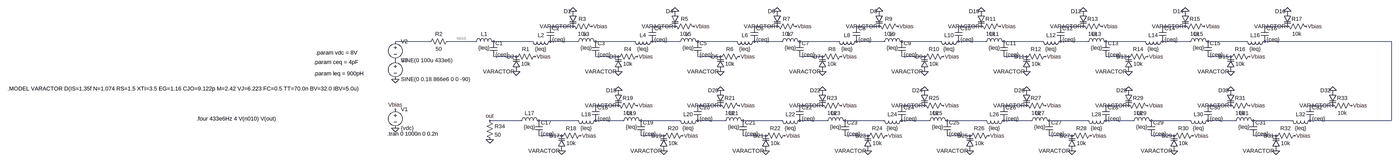
[diagram p0: schematic Parametric_amplifier_second_iteration(probably not working).asc, whole sheet]
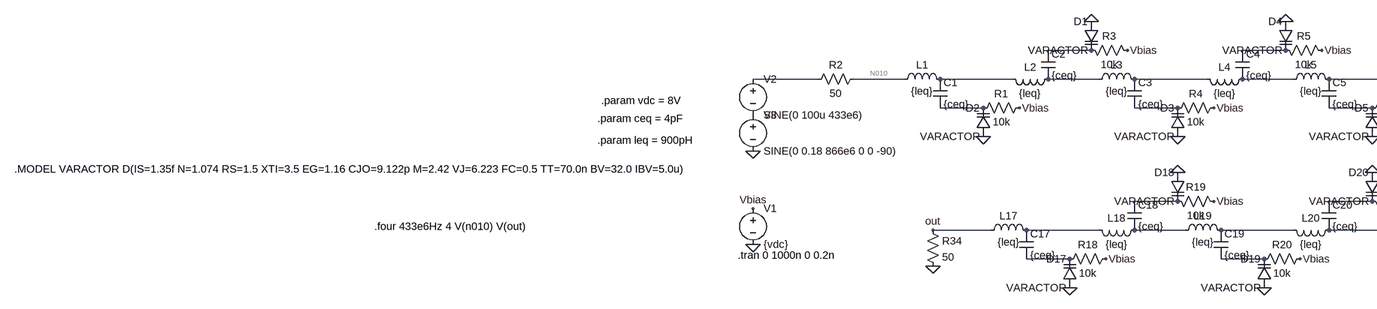
[diagram p1: schematic Parametric_amplifier_second_iteration(probably not working).asc, part, row 1 of 1, column 1 of 2]
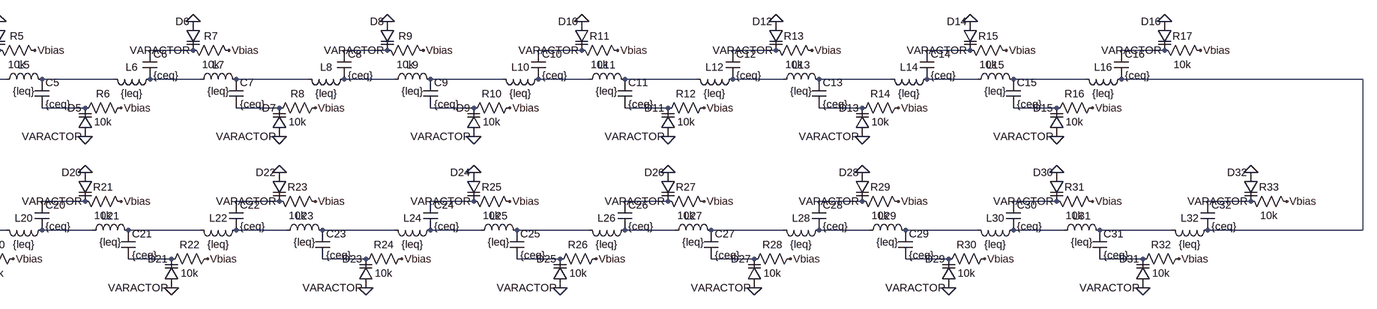
[diagram p2: schematic Parametric_amplifier_second_iteration(probably not working).asc, part, row 1 of 1, column 2 of 2]
Parametric_amplifier_second_iteration(probably not working).asc, the LTspice schematic file:
Version 4
SHEET 1 4228 680
WIRE 704 128 608 128
WIRE 1136 128 1040 128
WIRE 1568 128 1472 128
WIRE 2000 128 1904 128
WIRE 2432 128 2336 128
WIRE 2864 128 2768 128
WIRE 3296 128 3200 128
WIRE 3728 128 3632 128
WIRE 96 192 -48 192
WIRE 288 192 176 192
WIRE 528 192 368 192
WIRE 720 192 608 192
WIRE 960 192 800 192
WIRE 1152 192 1040 192
WIRE 1392 192 1232 192
WIRE 1584 192 1472 192
WIRE 1824 192 1664 192
WIRE 2016 192 1904 192
WIRE 2256 192 2096 192
WIRE 2448 192 2336 192
WIRE 2688 192 2528 192
WIRE 2880 192 2768 192
WIRE 3120 192 2960 192
WIRE 3312 192 3200 192
WIRE 3552 192 3392 192
WIRE 4224 192 3632 192
WIRE 464 256 368 256
WIRE 896 256 800 256
WIRE 1328 256 1232 256
WIRE 1760 256 1664 256
WIRE 2192 256 2096 256
WIRE 2624 256 2528 256
WIRE 3056 256 2960 256
WIRE 3488 256 3392 256
WIRE 896 464 800 464
WIRE 1328 464 1232 464
WIRE 1760 464 1664 464
WIRE 2192 464 2096 464
WIRE 2624 464 2528 464
WIRE 3056 464 2960 464
WIRE 3488 464 3392 464
WIRE 3920 464 3824 464
WIRE 480 528 352 528
WIRE 720 528 560 528
WIRE 912 528 800 528
WIRE 1152 528 992 528
WIRE 1344 528 1232 528
WIRE 1584 528 1424 528
WIRE 1776 528 1664 528
WIRE 2016 528 1856 528
WIRE 2208 528 2096 528
WIRE 2448 528 2288 528
WIRE 2640 528 2528 528
WIRE 2880 528 2720 528
WIRE 3072 528 2960 528
WIRE 3312 528 3152 528
WIRE 3504 528 3392 528
WIRE 3744 528 3584 528
WIRE 4224 528 4224 192
WIRE 4224 528 3824 528
WIRE 656 592 560 592
WIRE 1088 592 992 592
WIRE 1520 592 1424 592
WIRE 1952 592 1856 592
WIRE 2384 592 2288 592
WIRE 2816 592 2720 592
WIRE 3248 592 3152 592
WIRE 3680 592 3584 592
FLAG 464 320 0
FLAG 544 256 Vbias
FLAG -48 480 Vbias
FLAG -48 560 0
FLAG -48 352 0
FLAG 704 64 0
FLAG 784 128 Vbias
FLAG 896 320 0
FLAG 976 256 Vbias
FLAG 1136 64 0
FLAG 1216 128 Vbias
FLAG 1328 320 0
FLAG 1408 256 Vbias
FLAG 1568 64 0
FLAG 1648 128 Vbias
FLAG 1760 320 0
FLAG 1840 256 Vbias
FLAG 2000 64 0
FLAG 2080 128 Vbias
FLAG 2192 320 0
FLAG 2272 256 Vbias
FLAG 2432 64 0
FLAG 2512 128 Vbias
FLAG 2624 320 0
FLAG 2704 256 Vbias
FLAG 2864 64 0
FLAG 2944 128 Vbias
FLAG 3056 320 0
FLAG 3136 256 Vbias
FLAG 3296 64 0
FLAG 3376 128 Vbias
FLAG 3488 320 0
FLAG 3568 256 Vbias
FLAG 3728 64 0
FLAG 3808 128 Vbias
FLAG 656 656 0
FLAG 736 592 Vbias
FLAG 896 400 0
FLAG 976 464 Vbias
FLAG 1088 656 0
FLAG 1168 592 Vbias
FLAG 1328 400 0
FLAG 1408 464 Vbias
FLAG 1520 656 0
FLAG 1600 592 Vbias
FLAG 1760 400 0
FLAG 1840 464 Vbias
FLAG 1952 656 0
FLAG 2032 592 Vbias
FLAG 2192 400 0
FLAG 2272 464 Vbias
FLAG 2384 656 0
FLAG 2464 592 Vbias
FLAG 2624 400 0
FLAG 2704 464 Vbias
FLAG 2816 656 0
FLAG 2896 592 Vbias
FLAG 3056 400 0
FLAG 3136 464 Vbias
FLAG 3248 656 0
FLAG 3328 592 Vbias
FLAG 3488 400 0
FLAG 3568 464 Vbias
FLAG 3680 656 0
FLAG 3760 592 Vbias
FLAG 3920 400 0
FLAG 4000 464 Vbias
FLAG 352 608 0
FLAG 352 528 out
SYMBOL varactor 480 320 R180
WINDOW 0 24 64 Left 2
WINDOW 3 24 0 Left 2
SYMATTR InstName D2
SYMATTR Value VARACTOR
SYMBOL res 560 240 R90
WINDOW 0 0 56 VBottom 2
WINDOW 3 32 56 VTop 2
SYMATTR InstName R1
SYMATTR Value 10k
SYMBOL cap 352 192 R0
SYMATTR InstName C1
SYMATTR Value {ceq}
SYMBOL ind 272 208 R270
WINDOW 0 32 56 VTop 2
WINDOW 3 5 56 VBottom 2
SYMATTR InstName L1
SYMATTR Value {leq}
SYMBOL voltage -48 464 R0
WINDOW 123 0 0 Left 0
WINDOW 39 0 0 Left 0
SYMATTR InstName V1
SYMATTR Value {vdc}
SYMBOL voltage -48 176 R0
WINDOW 123 0 0 Left 0
WINDOW 39 0 0 Left 0
SYMATTR InstName V2
SYMATTR Value SINE(0 100u 433e6)
SYMBOL voltage -48 256 R0
WINDOW 123 0 0 Left 0
WINDOW 39 0 0 Left 0
SYMATTR InstName V3
SYMATTR Value SINE(0 0.18 866e6 0 0 -90)
SYMBOL res 192 176 R90
WINDOW 0 0 56 VBottom 2
WINDOW 3 32 56 VTop 2
SYMATTR InstName R2
SYMATTR Value 50
SYMBOL varactor 720 64 M0
SYMATTR InstName D1
SYMATTR Value VARACTOR
SYMBOL res 800 144 M270
WINDOW 0 32 56 VTop 2
WINDOW 3 0 56 VBottom 2
SYMATTR InstName R3
SYMATTR Value 10k
SYMBOL cap 592 192 M180
WINDOW 0 24 56 Left 2
WINDOW 3 24 8 Left 2
SYMATTR InstName C2
SYMATTR Value {ceq}
SYMBOL ind 512 176 M90
WINDOW 0 5 56 VBottom 2
WINDOW 3 32 56 VTop 2
SYMATTR InstName L2
SYMATTR Value {leq}
SYMBOL varactor 912 320 R180
WINDOW 0 24 64 Left 2
WINDOW 3 24 0 Left 2
SYMATTR InstName D3
SYMATTR Value VARACTOR
SYMBOL res 992 240 R90
WINDOW 0 0 56 VBottom 2
WINDOW 3 32 56 VTop 2
SYMATTR InstName R4
SYMATTR Value 10k
SYMBOL cap 784 192 R0
SYMATTR InstName C3
SYMATTR Value {ceq}
SYMBOL ind 704 208 R270
WINDOW 0 32 56 VTop 2
WINDOW 3 5 56 VBottom 2
SYMATTR InstName L3
SYMATTR Value {leq}
SYMBOL varactor 1152 64 M0
SYMATTR InstName D4
SYMATTR Value VARACTOR
SYMBOL res 1232 144 M270
WINDOW 0 32 56 VTop 2
WINDOW 3 0 56 VBottom 2
SYMATTR InstName R5
SYMATTR Value 10k
SYMBOL cap 1024 192 M180
WINDOW 0 24 56 Left 2
WINDOW 3 24 8 Left 2
SYMATTR InstName C4
SYMATTR Value {ceq}
SYMBOL ind 944 176 M90
WINDOW 0 5 56 VBottom 2
WINDOW 3 32 56 VTop 2
SYMATTR InstName L4
SYMATTR Value {leq}
SYMBOL varactor 1344 320 R180
WINDOW 0 24 64 Left 2
WINDOW 3 24 0 Left 2
SYMATTR InstName D5
SYMATTR Value VARACTOR
SYMBOL res 1424 240 R90
WINDOW 0 0 56 VBottom 2
WINDOW 3 32 56 VTop 2
SYMATTR InstName R6
SYMATTR Value 10k
SYMBOL cap 1216 192 R0
SYMATTR InstName C5
SYMATTR Value {ceq}
SYMBOL ind 1136 208 R270
WINDOW 0 32 56 VTop 2
WINDOW 3 5 56 VBottom 2
SYMATTR InstName L5
SYMATTR Value {leq}
SYMBOL varactor 1584 64 M0
SYMATTR InstName D6
SYMATTR Value VARACTOR
SYMBOL res 1664 144 M270
WINDOW 0 32 56 VTop 2
WINDOW 3 0 56 VBottom 2
SYMATTR InstName R7
SYMATTR Value 10k
SYMBOL cap 1456 192 M180
WINDOW 0 24 56 Left 2
WINDOW 3 24 8 Left 2
SYMATTR InstName C6
SYMATTR Value {ceq}
SYMBOL ind 1376 176 M90
WINDOW 0 5 56 VBottom 2
WINDOW 3 32 56 VTop 2
SYMATTR InstName L6
SYMATTR Value {leq}
SYMBOL varactor 1776 320 R180
WINDOW 0 24 64 Left 2
WINDOW 3 24 0 Left 2
SYMATTR InstName D7
SYMATTR Value VARACTOR
SYMBOL res 1856 240 R90
WINDOW 0 0 56 VBottom 2
WINDOW 3 32 56 VTop 2
SYMATTR InstName R8
SYMATTR Value 10k
SYMBOL cap 1648 192 R0
SYMATTR InstName C7
SYMATTR Value {ceq}
SYMBOL ind 1568 208 R270
WINDOW 0 32 56 VTop 2
WINDOW 3 5 56 VBottom 2
SYMATTR InstName L7
SYMATTR Value {leq}
SYMBOL varactor 2016 64 M0
SYMATTR InstName D8
SYMATTR Value VARACTOR
SYMBOL res 2096 144 M270
WINDOW 0 32 56 VTop 2
WINDOW 3 0 56 VBottom 2
SYMATTR InstName R9
SYMATTR Value 10k
SYMBOL cap 1888 192 M180
WINDOW 0 24 56 Left 2
WINDOW 3 24 8 Left 2
SYMATTR InstName C8
SYMATTR Value {ceq}
SYMBOL ind 1808 176 M90
WINDOW 0 5 56 VBottom 2
WINDOW 3 32 56 VTop 2
SYMATTR InstName L8
SYMATTR Value {leq}
SYMBOL varactor 2208 320 R180
WINDOW 0 24 64 Left 2
WINDOW 3 24 0 Left 2
SYMATTR InstName D9
SYMATTR Value VARACTOR
SYMBOL res 2288 240 R90
WINDOW 0 0 56 VBottom 2
WINDOW 3 32 56 VTop 2
SYMATTR InstName R10
SYMATTR Value 10k
SYMBOL cap 2080 192 R0
SYMATTR InstName C9
SYMATTR Value {ceq}
SYMBOL ind 2000 208 R270
WINDOW 0 32 56 VTop 2
WINDOW 3 5 56 VBottom 2
SYMATTR InstName L9
SYMATTR Value {leq}
SYMBOL varactor 2448 64 M0
SYMATTR InstName D10
SYMATTR Value VARACTOR
SYMBOL res 2528 144 M270
WINDOW 0 32 56 VTop 2
WINDOW 3 0 56 VBottom 2
SYMATTR InstName R11
SYMATTR Value 10k
SYMBOL cap 2320 192 M180
WINDOW 0 24 56 Left 2
WINDOW 3 24 8 Left 2
SYMATTR InstName C10
SYMATTR Value {ceq}
SYMBOL ind 2240 176 M90
WINDOW 0 5 56 VBottom 2
WINDOW 3 32 56 VTop 2
SYMATTR InstName L10
SYMATTR Value {leq}
SYMBOL varactor 2640 320 R180
WINDOW 0 24 64 Left 2
WINDOW 3 24 0 Left 2
SYMATTR InstName D11
SYMATTR Value VARACTOR
SYMBOL res 2720 240 R90
WINDOW 0 0 56 VBottom 2
WINDOW 3 32 56 VTop 2
SYMATTR InstName R12
SYMATTR Value 10k
SYMBOL cap 2512 192 R0
SYMATTR InstName C11
SYMATTR Value {ceq}
SYMBOL ind 2432 208 R270
WINDOW 0 32 56 VTop 2
WINDOW 3 5 56 VBottom 2
SYMATTR InstName L11
SYMATTR Value {leq}
SYMBOL varactor 2880 64 M0
SYMATTR InstName D12
SYMATTR Value VARACTOR
SYMBOL res 2960 144 M270
WINDOW 0 32 56 VTop 2
WINDOW 3 0 56 VBottom 2
SYMATTR InstName R13
SYMATTR Value 10k
SYMBOL cap 2752 192 M180
WINDOW 0 24 56 Left 2
WINDOW 3 24 8 Left 2
SYMATTR InstName C12
SYMATTR Value {ceq}
SYMBOL ind 2672 176 M90
WINDOW 0 5 56 VBottom 2
WINDOW 3 32 56 VTop 2
SYMATTR InstName L12
SYMATTR Value {leq}
SYMBOL varactor 3072 320 R180
WINDOW 0 24 64 Left 2
WINDOW 3 24 0 Left 2
SYMATTR InstName D13
SYMATTR Value VARACTOR
SYMBOL res 3152 240 R90
WINDOW 0 0 56 VBottom 2
WINDOW 3 32 56 VTop 2
SYMATTR InstName R14
SYMATTR Value 10k
SYMBOL cap 2944 192 R0
SYMATTR InstName C13
SYMATTR Value {ceq}
SYMBOL ind 2864 208 R270
WINDOW 0 32 56 VTop 2
WINDOW 3 5 56 VBottom 2
SYMATTR InstName L13
SYMATTR Value {leq}
SYMBOL varactor 3312 64 M0
SYMATTR InstName D14
SYMATTR Value VARACTOR
SYMBOL res 3392 144 M270
WINDOW 0 32 56 VTop 2
WINDOW 3 0 56 VBottom 2
SYMATTR InstName R15
SYMATTR Value 10k
SYMBOL cap 3184 192 M180
WINDOW 0 24 56 Left 2
WINDOW 3 24 8 Left 2
SYMATTR InstName C14
SYMATTR Value {ceq}
SYMBOL ind 3104 176 M90
WINDOW 0 5 56 VBottom 2
WINDOW 3 32 56 VTop 2
SYMATTR InstName L14
SYMATTR Value {leq}
SYMBOL varactor 3504 320 R180
WINDOW 0 24 64 Left 2
WINDOW 3 24 0 Left 2
SYMATTR InstName D15
SYMATTR Value VARACTOR
SYMBOL res 3584 240 R90
WINDOW 0 0 56 VBottom 2
WINDOW 3 32 56 VTop 2
SYMATTR InstName R16
SYMATTR Value 10k
SYMBOL cap 3376 192 R0
SYMATTR InstName C15
SYMATTR Value {ceq}
SYMBOL ind 3296 208 R270
WINDOW 0 32 56 VTop 2
WINDOW 3 5 56 VBottom 2
SYMATTR InstName L15
SYMATTR Value {leq}
SYMBOL varactor 3744 64 M0
SYMATTR InstName D16
SYMATTR Value VARACTOR
SYMBOL res 3824 144 M270
WINDOW 0 32 56 VTop 2
WINDOW 3 0 56 VBottom 2
SYMATTR InstName R17
SYMATTR Value 10k
SYMBOL cap 3616 192 M180
WINDOW 0 24 56 Left 2
WINDOW 3 24 8 Left 2
SYMATTR InstName C16
SYMATTR Value {ceq}
SYMBOL ind 3536 176 M90
WINDOW 0 5 56 VBottom 2
WINDOW 3 32 56 VTop 2
SYMATTR InstName L16
SYMATTR Value {leq}
SYMBOL varactor 672 656 R180
WINDOW 0 24 64 Left 2
WINDOW 3 24 0 Left 2
SYMATTR InstName D17
SYMATTR Value VARACTOR
SYMBOL res 752 576 R90
WINDOW 0 0 56 VBottom 2
WINDOW 3 32 56 VTop 2
SYMATTR InstName R18
SYMATTR Value 10k
SYMBOL cap 544 528 R0
SYMATTR InstName C17
SYMATTR Value {ceq}
SYMBOL ind 464 544 R270
WINDOW 0 32 56 VTop 2
WINDOW 3 5 56 VBottom 2
SYMATTR InstName L17
SYMATTR Value {leq}
SYMBOL varactor 912 400 M0
SYMATTR InstName D18
SYMATTR Value VARACTOR
SYMBOL res 992 480 M270
WINDOW 0 32 56 VTop 2
WINDOW 3 0 56 VBottom 2
SYMATTR InstName R19
SYMATTR Value 10k
SYMBOL cap 784 528 M180
WINDOW 0 24 56 Left 2
WINDOW 3 24 8 Left 2
SYMATTR InstName C18
SYMATTR Value {ceq}
SYMBOL ind 704 512 M90
WINDOW 0 5 56 VBottom 2
WINDOW 3 32 56 VTop 2
SYMATTR InstName L18
SYMATTR Value {leq}
SYMBOL varactor 1104 656 R180
WINDOW 0 24 64 Left 2
WINDOW 3 24 0 Left 2
SYMATTR InstName D19
SYMATTR Value VARACTOR
SYMBOL res 1184 576 R90
WINDOW 0 0 56 VBottom 2
WINDOW 3 32 56 VTop 2
SYMATTR InstName R20
SYMATTR Value 10k
SYMBOL cap 976 528 R0
SYMATTR InstName C19
SYMATTR Value {ceq}
SYMBOL ind 896 544 R270
WINDOW 0 32 56 VTop 2
WINDOW 3 5 56 VBottom 2
SYMATTR InstName L19
SYMATTR Value {leq}
SYMBOL varactor 1344 400 M0
SYMATTR InstName D20
SYMATTR Value VARACTOR
SYMBOL res 1424 480 M270
WINDOW 0 32 56 VTop 2
WINDOW 3 0 56 VBottom 2
SYMATTR InstName R21
SYMATTR Value 10k
SYMBOL cap 1216 528 M180
WINDOW 0 24 56 Left 2
WINDOW 3 24 8 Left 2
SYMATTR InstName C20
SYMATTR Value {ceq}
SYMBOL ind 1136 512 M90
WINDOW 0 5 56 VBottom 2
WINDOW 3 32 56 VTop 2
SYMATTR InstName L20
SYMATTR Value {leq}
SYMBOL varactor 1536 656 R180
WINDOW 0 24 64 Left 2
WINDOW 3 24 0 Left 2
SYMATTR InstName D21
SYMATTR Value VARACTOR
SYMBOL res 1616 576 R90
WINDOW 0 0 56 VBottom 2
WINDOW 3 32 56 VTop 2
SYMATTR InstName R22
SYMATTR Value 10k
SYMBOL cap 1408 528 R0
SYMATTR InstName C21
SYMATTR Value {ceq}
SYMBOL ind 1328 544 R270
WINDOW 0 32 56 VTop 2
WINDOW 3 5 56 VBottom 2
SYMATTR InstName L21
SYMATTR Value {leq}
SYMBOL varactor 1776 400 M0
SYMATTR InstName D22
SYMATTR Value VARACTOR
SYMBOL res 1856 480 M270
WINDOW 0 32 56 VTop 2
WINDOW 3 0 56 VBottom 2
SYMATTR InstName R23
SYMATTR Value 10k
SYMBOL cap 1648 528 M180
WINDOW 0 24 56 Left 2
WINDOW 3 24 8 Left 2
SYMATTR InstName C22
SYMATTR Value {ceq}
SYMBOL ind 1568 512 M90
WINDOW 0 5 56 VBottom 2
WINDOW 3 32 56 VTop 2
SYMATTR InstName L22
SYMATTR Value {leq}
SYMBOL varactor 1968 656 R180
WINDOW 0 24 64 Left 2
WINDOW 3 24 0 Left 2
SYMATTR InstName D23
SYMATTR Value VARACTOR
SYMBOL res 2048 576 R90
WINDOW 0 0 56 VBottom 2
WINDOW 3 32 56 VTop 2
SYMATTR InstName R24
SYMATTR Value 10k
SYMBOL cap 1840 528 R0
SYMATTR InstName C23
SYMATTR Value {ceq}
SYMBOL ind 1760 544 R270
WINDOW 0 32 56 VTop 2
WINDOW 3 5 56 VBottom 2
SYMATTR InstName L23
SYMATTR Value {leq}
SYMBOL varactor 2208 400 M0
SYMATTR InstName D24
SYMATTR Value VARACTOR
SYMBOL res 2288 480 M270
WINDOW 0 32 56 VTop 2
WINDOW 3 0 56 VBottom 2
SYMATTR InstName R25
SYMATTR Value 10k
SYMBOL cap 2080 528 M180
WINDOW 0 24 56 Left 2
WINDOW 3 24 8 Left 2
SYMATTR InstName C24
SYMATTR Value {ceq}
SYMBOL ind 2000 512 M90
WINDOW 0 5 56 VBottom 2
WINDOW 3 32 56 VTop 2
SYMATTR InstName L24
SYMATTR Value {leq}
SYMBOL varactor 2400 656 R180
WINDOW 0 24 64 Left 2
WINDOW 3 24 0 Left 2
SYMATTR InstName D25
SYMATTR Value VARACTOR
SYMBOL res 2480 576 R90
WINDOW 0 0 56 VBottom 2
WINDOW 3 32 56 VTop 2
SYMATTR InstName R26
SYMATTR Value 10k
SYMBOL cap 2272 528 R0
SYMATTR InstName C25
SYMATTR Value {ceq}
SYMBOL ind 2192 544 R270
WINDOW 0 32 56 VTop 2
WINDOW 3 5 56 VBottom 2
SYMATTR InstName L25
SYMATTR Value {leq}
SYMBOL varactor 2640 400 M0
SYMATTR InstName D26
SYMATTR Value VARACTOR
SYMBOL res 2720 480 M270
WINDOW 0 32 56 VTop 2
WINDOW 3 0 56 VBottom 2
SYMATTR InstName R27
SYMATTR Value 10k
SYMBOL cap 2512 528 M180
WINDOW 0 24 56 Left 2
WINDOW 3 24 8 Left 2
SYMATTR InstName C26
SYMATTR Value {ceq}
SYMBOL ind 2432 512 M90
WINDOW 0 5 56 VBottom 2
WINDOW 3 32 56 VTop 2
SYMATTR InstName L26
SYMATTR Value {leq}
SYMBOL varactor 2832 656 R180
WINDOW 0 24 64 Left 2
WINDOW 3 24 0 Left 2
SYMATTR InstName D27
SYMATTR Value VARACTOR
SYMBOL res 2912 576 R90
WINDOW 0 0 56 VBottom 2
WINDOW 3 32 56 VTop 2
SYMATTR InstName R28
SYMATTR Value 10k
SYMBOL cap 2704 528 R0
SYMATTR InstName C27
SYMATTR Value {ceq}
SYMBOL ind 2624 544 R270
WINDOW 0 32 56 VTop 2
WINDOW 3 5 56 VBottom 2
SYMATTR InstName L27
SYMATTR Value {leq}
SYMBOL varactor 3072 400 M0
SYMATTR InstName D28
SYMATTR Value VARACTOR
SYMBOL res 3152 480 M270
WINDOW 0 32 56 VTop 2
WINDOW 3 0 56 VBottom 2
SYMATTR InstName R29
SYMATTR Value 10k
SYMBOL cap 2944 528 M180
WINDOW 0 24 56 Left 2
WINDOW 3 24 8 Left 2
SYMATTR InstName C28
SYMATTR Value {ceq}
SYMBOL ind 2864 512 M90
WINDOW 0 5 56 VBottom 2
WINDOW 3 32 56 VTop 2
SYMATTR InstName L28
SYMATTR Value {leq}
SYMBOL varactor 3264 656 R180
WINDOW 0 24 64 Left 2
WINDOW 3 24 0 Left 2
SYMATTR InstName D29
SYMATTR Value VARACTOR
SYMBOL res 3344 576 R90
WINDOW 0 0 56 VBottom 2
WINDOW 3 32 56 VTop 2
SYMATTR InstName R30
SYMATTR Value 10k
SYMBOL cap 3136 528 R0
SYMATTR InstName C29
SYMATTR Value {ceq}
SYMBOL ind 3056 544 R270
WINDOW 0 32 56 VTop 2
WINDOW 3 5 56 VBottom 2
SYMATTR InstName L29
SYMATTR Value {leq}
SYMBOL varactor 3504 400 M0
SYMATTR InstName D30
SYMATTR Value VARACTOR
SYMBOL res 3584 480 M270
WINDOW 0 32 56 VTop 2
WINDOW 3 0 56 VBottom 2
SYMATTR InstName R31
SYMATTR Value 10k
SYMBOL cap 3376 528 M180
WINDOW 0 24 56 Left 2
WINDOW 3 24 8 Left 2
SYMATTR InstName C30
SYMATTR Value {ceq}
SYMBOL ind 3296 512 M90
WINDOW 0 5 56 VBottom 2
WINDOW 3 32 56 VTop 2
SYMATTR InstName L30
SYMATTR Value {leq}
SYMBOL varactor 3696 656 R180
WINDOW 0 24 64 Left 2
WINDOW 3 24 0 Left 2
SYMATTR InstName D31
SYMATTR Value VARACTOR
SYMBOL res 3776 576 R90
WINDOW 0 0 56 VBottom 2
WINDOW 3 32 56 VTop 2
SYMATTR InstName R32
SYMATTR Value 10k
SYMBOL cap 3568 528 R0
SYMATTR InstName C31
SYMATTR Value {ceq}
SYMBOL ind 3488 544 R270
WINDOW 0 32 56 VTop 2
WINDOW 3 5 56 VBottom 2
SYMATTR InstName L31
SYMATTR Value {leq}
SYMBOL varactor 3936 400 M0
SYMATTR InstName D32
SYMATTR Value VARACTOR
SYMBOL res 4016 480 M270
WINDOW 0 32 56 VTop 2
WINDOW 3 0 56 VBottom 2
SYMATTR InstName R33
SYMATTR Value 10k
SYMBOL cap 3808 528 M180
WINDOW 0 24 56 Left 2
WINDOW 3 24 8 Left 2
SYMATTR InstName C32
SYMATTR Value {ceq}
SYMBOL ind 3728 512 M90
WINDOW 0 5 56 VBottom 2
WINDOW 3 32 56 VTop 2
SYMATTR InstName L32
SYMATTR Value {leq}
SYMBOL res 336 512 R0
SYMATTR InstName R34
SYMATTR Value 50
TEXT -1776 392 Left 2 !.MODEL VARACTOR D(IS=1.35f N=1.074 RS=1.5 XTI=3.5 EG=1.16 CJO=9.122p M=2.42 VJ=6.223 FC=0.5 TT=70.0n BV=32.0 IBV=5.0u)
TEXT -480 328 Left 2 !.param leq = 900pH
TEXT -480 280 Left 2 !.param ceq = 4pF
TEXT -472 240 Left 2 !.param vdc = 8V
TEXT -82 584 Left 2 !.tran 0 1000n 0 0.2n
TEXT -976 520 Left 2 !.four 433e6Hz 4 V(n010) V(out)

The netlist it stands for:
* Parametric_amplifier_second_iteration(probably not working).asc
D2 0 N027 VARACTOR
R1 Vbias N027 10k
C1 N011 N027 {ceq}
L1 N010 N011 {leq}
V1 Vbias 0 {vdc}
V2 N009 P001 SINE(0 100u 433e6)
V3 P001 0 SINE(0 0.18 866e6 0 0 -90)
R2 N010 N009 50
D1 0 N001 VARACTOR
R3 Vbias N001 10k
C2 N012 N001 {ceq}
L2 N011 N012 {leq}
D3 0 N028 VARACTOR
R4 Vbias N028 10k
C3 N013 N028 {ceq}
L3 N012 N013 {leq}
D4 0 N002 VARACTOR
R5 Vbias N002 10k
C4 N014 N002 {ceq}
L4 N013 N014 {leq}
D5 0 N029 VARACTOR
R6 Vbias N029 10k
C5 N015 N029 {ceq}
L5 N014 N015 {leq}
D6 0 N003 VARACTOR
R7 Vbias N003 10k
C6 N016 N003 {ceq}
L6 N015 N016 {leq}
D7 0 N030 VARACTOR
R8 Vbias N030 10k
C7 N017 N030 {ceq}
L7 N016 N017 {leq}
D8 0 N004 VARACTOR
R9 Vbias N004 10k
C8 N018 N004 {ceq}
L8 N017 N018 {leq}
D9 0 N031 VARACTOR
R10 Vbias N031 10k
C9 N019 N031 {ceq}
L9 N018 N019 {leq}
D10 0 N005 VARACTOR
R11 Vbias N005 10k
C10 N020 N005 {ceq}
L10 N019 N020 {leq}
D11 0 N032 VARACTOR
R12 Vbias N032 10k
C11 N021 N032 {ceq}
L11 N020 N021 {leq}
D12 0 N006 VARACTOR
R13 Vbias N006 10k
C12 N022 N006 {ceq}
L12 N021 N022 {leq}
D13 0 N033 VARACTOR
R14 Vbias N033 10k
C13 N023 N033 {ceq}
L13 N022 N023 {leq}
D14 0 N007 VARACTOR
R15 Vbias N007 10k
C14 N024 N007 {ceq}
L14 N023 N024 {leq}
D15 0 N034 VARACTOR
R16 Vbias N034 10k
C15 N025 N034 {ceq}
L15 N024 N025 {leq}
D16 0 N008 VARACTOR
R17 Vbias N008 10k
C16 N026 N008 {ceq}
L16 N025 N026 {leq}
D17 0 N058 VARACTOR
R18 Vbias N058 10k
C17 N043 N058 {ceq}
L17 out N043 {leq}
D18 0 N035 VARACTOR
R19 Vbias N035 10k
C18 N044 N035 {ceq}
L18 N043 N044 {leq}
D19 0 N059 VARACTOR
R20 Vbias N059 10k
C19 N045 N059 {ceq}
L19 N044 N045 {leq}
D20 0 N036 VARACTOR
R21 Vbias N036 10k
C20 N046 N036 {ceq}
L20 N045 N046 {leq}
D21 0 N060 VARACTOR
R22 Vbias N060 10k
C21 N047 N060 {ceq}
L21 N046 N047 {leq}
D22 0 N037 VARACTOR
R23 Vbias N037 10k
C22 N048 N037 {ceq}
L22 N047 N048 {leq}
D23 0 N061 VARACTOR
R24 Vbias N061 10k
C23 N049 N061 {ceq}
L23 N048 N049 {leq}
D24 0 N038 VARACTOR
R25 Vbias N038 10k
C24 N050 N038 {ceq}
L24 N049 N050 {leq}
D25 0 N062 VARACTOR
R26 Vbias N062 10k
C25 N051 N062 {ceq}
L25 N050 N051 {leq}
D26 0 N039 VARACTOR
R27 Vbias N039 10k
C26 N052 N039 {ceq}
L26 N051 N052 {leq}
D27 0 N063 VARACTOR
R28 Vbias N063 10k
C27 N053 N063 {ceq}
L27 N052 N053 {leq}
D28 0 N040 VARACTOR
R29 Vbias N040 10k
C28 N054 N040 {ceq}
L28 N053 N054 {leq}
D29 0 N064 VARACTOR
R30 Vbias N064 10k
C29 N055 N064 {ceq}
L29 N054 N055 {leq}
D30 0 N041 VARACTOR
R31 Vbias N041 10k
C30 N056 N041 {ceq}
L30 N055 N056 {leq}
D31 0 N065 VARACTOR
R32 Vbias N065 10k
C31 N057 N065 {ceq}
L31 N056 N057 {leq}
D32 0 N042 VARACTOR
R33 Vbias N042 10k
C32 N026 N042 {ceq}
L32 N057 N026 {leq}
R34 out 0 50
.model D D
.lib standard.dio
.MODEL VARACTOR D(IS=1.35f N=1.074 RS=1.5 XTI=3.5 EG=1.16 CJO=9.122p M=2.42 VJ=6.223 FC=0.5 TT=70.0n BV=32.0 IBV=5.0u)
.param leq = 900pH
.param ceq = 4pF
.param vdc = 8V
.tran 0 1000n 0 0.2n
.four 433e6Hz 4 V(n010) V(out)
.backanno
.end